# EAGLE design pressureMv4 (EAGLE 7.5.0)
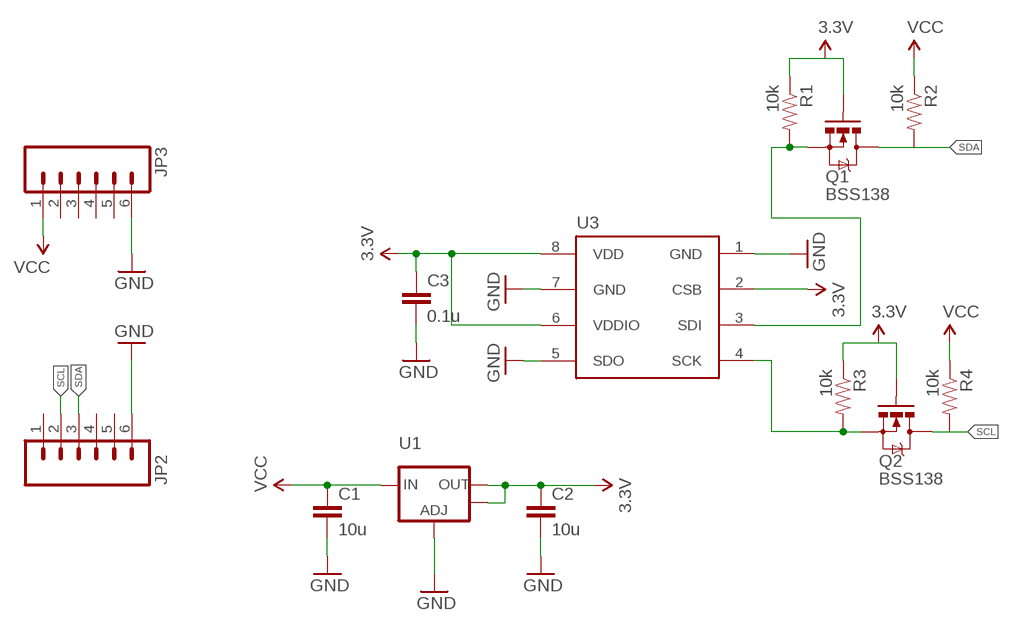
[diagram p0: schematic, sheet 1]

## Parts
C1  10u  CAP0805  [0805]
C2  10u  CAP0805  [0805]
C3  0.1u  CAP0805  [0805]
JP2  M06LOCK_LONGPADS  [1X06_LOCK_LONGPADS]
JP3  M06LOCK_LONGPADS  [1X06_LOCK_LONGPADS]
Q1  BSS138  MOSFET-NCHANNEL2N7002PW  [SOT323]
Q2  BSS138  MOSFET-NCHANNEL2N7002PW  [SOT323]
R1  10k  RESISTOR0805-RES  [0805]
R2  10k  RESISTOR0805-RES  [0805]
R3  10k  RESISTOR0805-RES  [0805]
R4  10k  RESISTOR0805-RES  [0805]
U1  V_REG_LM1117SOT223  [SOT223]
U3  BME280SMD  [BME280]

## Nets
3.3V: C2.1 C3.1 Q1.1(G) Q2.1(G) R1.1 R3.1 U1.2(OUT) U1.4(OUT) U3.2(CSB) U3.6(VDDIO) U3.8(VDD)
GND: C1.2 C2.2 C3.2 JP2.6 JP3.6 U1.1(ADJ) U3.1(GND) U3.5(SDO) U3.7(GND)
N$1: Q1.2(S) R1.2 U3.3(SDI)
N$2: Q2.2(S) R3.2 U3.4(SCK)
SCL: JP2.2 Q2.3(D) R4.2
SDA: JP2.3 Q1.3(D) R2.2
VCC: C1.1 JP3.1 R2.1 R4.1 U1.3(IN)
Unconnected: JP2.1 JP2.4 JP2.5 JP3.2 JP3.3 JP3.4 JP3.5

## Library data of the parts
C1-C3 = SparkFun-Capacitors:CAP: Capacitor Standard 0603 ceramic capacitor, and 0.1" leaded capacitor.
JP2 JP3 = SparkFun:M06: Header 6 Standard 6-pin 0.1" header. Use with straight break away headers (SKU : PRT-00116), right angle break away headers (PRT-00553), swiss pins (PRT-00743), machine pins (PRT-00117), and female headers (PRT-00115). Molex polarized connector foot print use with SKU : PRT-08094 with associated crimp pins and housings. NOTES ON THE VARIANTS LOCK and LOCK_LONGPADS... This footprint was designed to help hold the alignment of a through-hole component (i.e. 6-pin header) while soldering it into place. You may notice that each hole has been shifted either up or down by 0.005 of an inch from it's more standard position (which is a perfectly straight line). This slight alteration caused the pins (the squares in the middle) to touch the edges of the holes. Because they are alternating, it causes a "brace" to hold the component in place. 0.005 has proven to be the perfect amount of "off-center" position when using our standard breakaway headers. Although looks a little odd when you look at the bare footprint, once you have a header in there, the alteration is very hard to notice. Also, if you push a header all the way into place, it is covered up entirely on the bottom side. This idea of altering the position of holes to aid alignment will be further integrated into the Sparkfun Library for other footprints. It can help hold any component with 3 or more connection pins.
Q1 Q2 = SparkFun-DiscreteSemi:MOSFET-NCHANNEL: Common NMOSFET Parts MFG P/N Store ID Prod ID FDD8780 TRANS-09984 SI7820DN TRANS-11055 FDS6630A IC-08089 2N7002PW TRANS-11151 FQP30N06L COM-10213 TRANS-10060 BSS123LT1G TRANS-08345 BSS138 TRANS-00830 BS170 2N7000; PROD_ID: TRANS-11151
R1-R4 = SparkFun-Passives:RESISTOR: Resistor Basic schematic elements and footprints for 0603, 1206, and PTH resistors.
U1 = SparkFun-PowerIC:V_REG_LM1117: Voltage Regulator LM1117 Standard adjustable voltage regulator but in SMD form. Spark Fun Electronics SKU : COM-00595
U3 = exoteric-analytics-custom:BME280

## Board
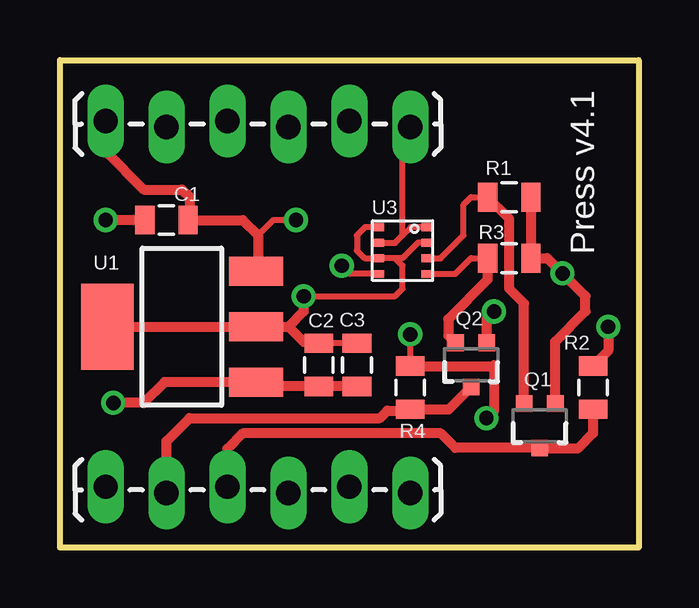
[diagram p1: board, top side]
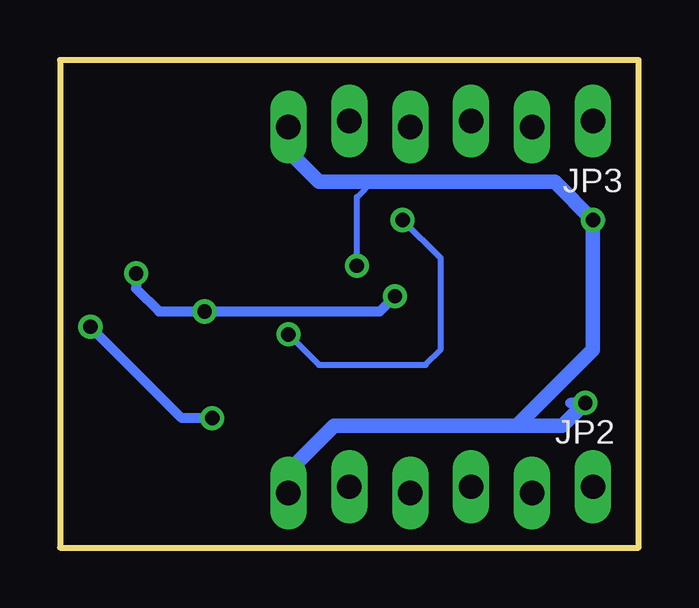
[diagram p2: board, bottom side, seen from below]

Size 24.13 x 20.32 mm. Coordinates in mm from the lower left corner, seen from the top.
Outline: 0,0 0,20.32 24.13,20.32 24.13,0 0,0
Copper layers (1*16): Top 0.035mm / dielectric 1.5mm / Bottom 0.035mm
Design rules "default": minimum track width 10mil, minimum drill 20mil, track to track 8mil, track to pad 8mil, pad to pad 8mil, via to via 8mil, smd to smd 8mil, copper to edge 24mil, drill to drill 8mil, minimum pad ring 10mil, minimum via ring 8mil, stop-mask expansion 4mil, vias tented up to drill 0mil, thermal gap 10mil

### Footprints (pad centres in the part's own frame; a part is rotated, then mirrored left to right if it is on the bottom)
0805 = smd 0.8 x 1.2: 1 -0.9,0; 2 0.9,0
1X06_LOCK_LONGPADS = drill 1.016 long: 1 0,0; 2 2.54,-0.254; 3 5.08,0; 4 7.62,-0.254; 5 10.16,0; 6 12.7,-0.254
SOT323 = smd 0.7 x 0.7: 1 -0.65,-0.925; 2 0.65,-0.925; 3 0,0.925
SOT223 = smd 1.219 x 2.235: 1 -2.311,-3.099; 2 0,-3.099; 3 2.311,-3.099 | smd 3.6 x 2.2: 4 0,3.099
BME280 = smd 0.5 x 0.325: 1 1.025,0.975; 2 1.025,0.325; 3 1.025,-0.325; 4 1.025,-0.975; 5 -1.025,-0.975; 6 -1.025,-0.325; 7 -1.025,0.325; 8 -1.025,0.975

### Placement (x,y rotation side)
C1  4.45,13.65 180 top
C2  10.79,7.62 270 top
C3  12.38,7.62 270 top
JP2  1.91,2.54 0 top
JP3  1.91,17.78 0 top
Q1  20,5.08 180 top
Q2  17.14,7.62 180 top
R1  18.73,14.61 180 top
R2  22.23,6.67 270 top
R3  18.73,12.06 180 top
R4  14.61,6.67 270 top
U1  5.08,9.21 90 top
U3  14.29,12.38 0 top

### Tracks (layer width: path | path; a pad name or v marks a point on that pad's centre or on a via)
3.3V  (via drill 0.6)
  Top 0.254: C3.1 C2.1 | U3.2 14.93,12.71 14.29,12.06 13.97,12.06 | 13.97,12.06 U3.6 12.7,12.06 12.38,12.38 12.38,13.02 12.72,13.36 U3.8 | v10.16,10.48 13.97,10.48 14.29,10.79 14.29,11.75 13.97,12.06
  Top 0.406: 9.53,9.21 U1.2 U1.4 | 9.53,9.21 10.16,8.57 10.74,8.57 C2.1 | R1.1 R3.1 20.32,12.06 v20.95,11.43 21.91,10.48 21.91,9.84 20.65,8.59 Q1.1 | 17.82,8.57 Q2.1 17.8,9.54 v18.1,9.84 | v10.16,10.48 10.16,9.84 9.53,9.21
  Bottom 0.406: v10.16,10.48 10.79,9.84 v18.1,9.84 20,9.84 20.95,10.79 v20.95,11.43
GND  (via drill 0.6)
  Top 0.254: U3.1 14.63,13.36 14.29,13.02 | U3.7 13.97,12.7 14.29,13.02 | U3.5 12.09,11.41 v11.75,11.75 | 14.29,13.02 14.29,17.21 JP3.6
  Top 0.406: C1.2 v1.91,13.65 | C3.2 C2.2 8.36,6.72 U1.1 4.36,6.9 3.49,6.03 v2.22,6.03
  Bottom 0.254: v11.75,11.75 11.75,14.61 11.11,15.24
  Bottom 0.406: v1.91,13.65 1.59,13.65 | v2.22,6.03 2.86,6.03
  Bottom 0.61: JP2.6 14.61,3.17 12.7,5.08 5.08,5.08 | 5.08,5.08 1.91,8.26 v1.91,13.65 3.49,15.24 11.11,15.24 13.34,15.24 14.61,16.51 JP3.6 | 5.08,5.08 3.17,5.08 v2.22,6.03
N$1
  Top 0.254: U3.3 15.87,12.06 16.83,13.02 16.83,14.29 17.14,14.61 R1.2
  Top 0.406: Q1.2 19.35,10.18 18.73,10.79 18.73,13.71 R1.2
N$2
  Top 0.254: U3.4 16.49,11.41 17.14,12.06 R3.2
  Top 0.406: R3.2 17.83,11.16 16.19,9.53 16.19,8.85 Q2.2
SCL
  Top 0.406: JP2.2 4.45,4.45 5.4,5.4 13.34,5.4 13.65,5.71 14.55,5.71 R4.2 16.22,5.77 Q2.3
SDA
  Top 0.406: JP2.3 6.99,4.13 7.62,4.76 15.88,4.76 16.48,4.16 Q1.3 20.03,4.13 21.59,4.13 22.23,4.76 R2.2
VCC  (via drill 0.6)
  Top 0.254: R4.1 v14.61,8.89 | v9.84,13.65 8.89,13.65 8.26,13.02
  Top 0.406: JP3.1 1.91,16.51 3.49,14.92 5.08,14.92 5.4,14.61 5.4,13.71 C1.1 7.62,13.65 8.26,13.02 8.26,11.6 U1.3 | R4.1 18.05,7.57 18.1,7.62 18.1,5.71 v17.78,5.4 | v22.86,9.21 22.86,8.2 R2.1
  Bottom 0.254: v14.61,8.89 14.29,8.89 14.29,8.57 13.34,7.62 8.89,7.62 8.26,8.26 8.26,12.06 v9.84,13.65
  Bottom 0.406: v17.78,5.4 19.05,5.4 v22.86,9.21

### Text on the board
tPlace: Press v4.1